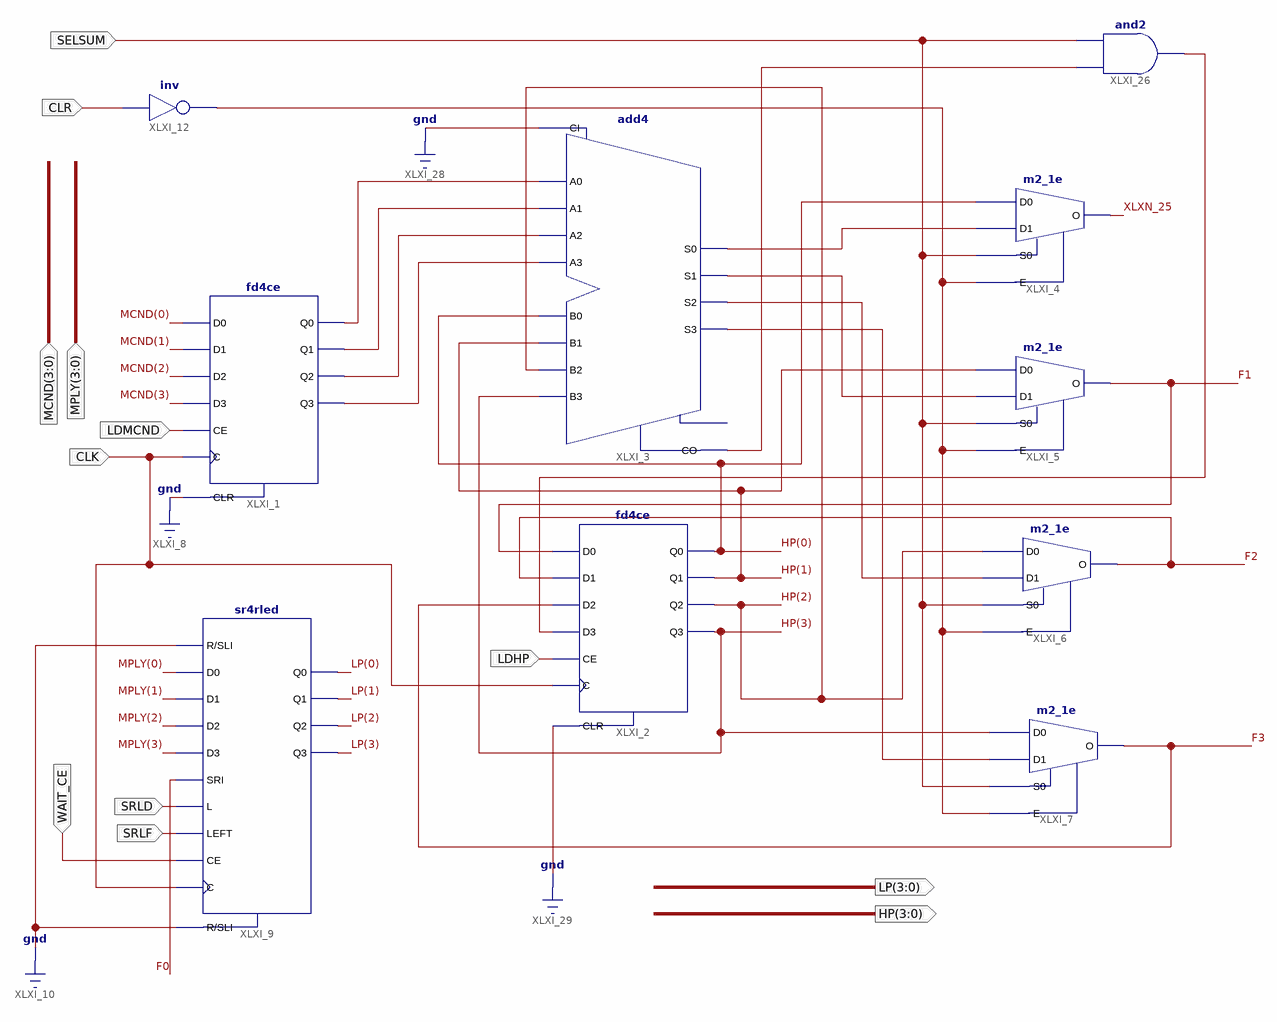
[diagram p0: schematic sheet 1]
// Xilinx ISE schematic dataUnit.sch (spartan3) as structural Verilog: 10 symbols, 12 ports
module dataUnit (
  input  LDMCND,
  input  SRLD,
  input  WAIT_CE,
  input  LDHP,
  input  SRLF,
  input  CLR,
  input  SELSUM,
  input  CLK,
  input  [3:0] MCND,
  input  [3:0] MPLY,
  output [3:0] LP,
  output [3:0] HP
);

  wire F0, F1, F2, F3, XLXN_7, XLXN_8, XLXN_9, XLXN_10, XLXN_25, XLXN_35, XLXN_101, XLXN_102, XLXN_103,
       XLXN_104, XLXN_106, XLXN_111;

  fd4ce XLXI_1 (
    .C(CLK), .CE(LDMCND), .CLR(1'b0), .D0(MCND[0]), .D1(MCND[1]), .D2(MCND[2]), .D3(MCND[3]), .Q0(XLXN_7),
    .Q1(XLXN_8), .Q2(XLXN_9), .Q3(XLXN_10));
  fd4ce XLXI_2 (
    .C(CLK), .CE(LDHP), .CLR(1'b0), .D0(F1), .D1(F2), .D2(F3), .D3(XLXN_111), .Q0(HP[0]), .Q1(HP[1]),
    .Q2(HP[2]), .Q3(HP[3]));
  add4 XLXI_3 (
    .A0(XLXN_7), .A1(XLXN_8), .A2(XLXN_9), .A3(XLXN_10), .B0(HP[0]), .B1(HP[1]), .B2(HP[2]), .B3(HP[3]),
    .CI(1'b0), .CO(XLXN_106), .S0(XLXN_101), .S1(XLXN_102), .S2(XLXN_103), .S3(XLXN_104));  // open: OFL
  m2_1e XLXI_4 (.D0(HP[0]), .D1(XLXN_101), .E(XLXN_35), .S0(SELSUM), .O(XLXN_25));
  m2_1e XLXI_5 (.D0(HP[1]), .D1(XLXN_102), .E(XLXN_35), .S0(SELSUM), .O(F1));
  m2_1e XLXI_6 (.D0(HP[2]), .D1(XLXN_103), .E(XLXN_35), .S0(SELSUM), .O(F2));
  m2_1e XLXI_7 (.D0(HP[3]), .D1(XLXN_104), .E(XLXN_35), .S0(SELSUM), .O(F3));
  sr4rled XLXI_9 (
    .C(CLK), .CE(WAIT_CE), .D0(MPLY[0]), .D1(MPLY[1]), .D2(MPLY[2]), .D3(MPLY[3]), .L(SRLD), .LEFT(SRLF),
    .R(1'b0), .SLI(1'b0), .SRI(F0), .Q0(LP[0]), .Q1(LP[1]), .Q2(LP[2]), .Q3(LP[3]));
  and XLXI_26 (XLXN_111, XLXN_106, SELSUM);
  not XLXI_12 (XLXN_35, CLR);
endmodule
